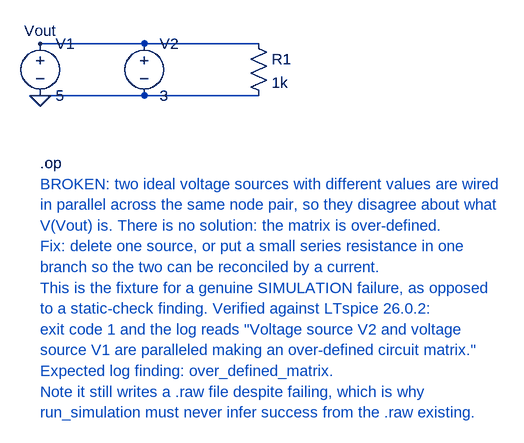
[diagram p0: schematic source_conflict.asc]
source_conflict.asc, the LTspice schematic file:
Version 4.1
SHEET 1 880 680
WIRE 0 16 160 16
WIRE 160 16 336 16
WIRE 0 96 160 96
WIRE 160 96 336 96
FLAG 0 96 0
FLAG 0 16 Vout
SYMBOL voltage 0 0 R0
WINDOW 123 24 124 Left 2
WINDOW 39 0 0 Left 0
SYMATTR InstName V1
SYMATTR Value 5
SYMBOL voltage 160 0 R0
WINDOW 123 24 124 Left 2
WINDOW 39 0 0 Left 0
SYMATTR InstName V2
SYMATTR Value 3
SYMBOL res 320 0 R0
SYMATTR InstName R1
SYMATTR Value 1k
TEXT 0 200 Left 2 !.op
TEXT 0 232 Left 2 ;BROKEN: two ideal voltage sources with different values are wired
TEXT 0 264 Left 2 ;in parallel across the same node pair, so they disagree about what
TEXT 0 296 Left 2 ;V(Vout) is. There is no solution: the matrix is over-defined.
TEXT 0 328 Left 2 ;Fix: delete one source, or put a small series resistance in one
TEXT 0 360 Left 2 ;branch so the two can be reconciled by a current.
TEXT 0 392 Left 2 ;This is the fixture for a genuine SIMULATION failure, as opposed
TEXT 0 424 Left 2 ;to a static-check finding. Verified against LTspice 26.0.2:
TEXT 0 456 Left 2 ;exit code 1 and the log reads "Voltage source V2 and voltage
TEXT 0 488 Left 2 ;source V1 are paralleled making an over-defined circuit matrix."
TEXT 0 520 Left 2 ;Expected log finding: over_defined_matrix.
TEXT 0 552 Left 2 ;Note it still writes a .raw file despite failing, which is why
TEXT 0 584 Left 2 ;run_simulation must never infer success from the .raw existing.

The netlist it stands for:
* source_conflict.asc
V1 Vout 0 5
V2 Vout 0 3
R1 Vout 0 1k
.op
* BROKEN: two ideal voltage sources with different values are wired
* in parallel across the same node pair, so they disagree about what
* V(Vout) is. There is no solution: the matrix is over-defined.
* Fix: delete one source, or put a small series resistance in one
* branch so the two can be reconciled by a current.
* This is the fixture for a genuine SIMULATION failure, as opposed
* to a static-check finding. Verified against LTspice 26.0.2:
* exit code 1 and the log reads "Voltage source V2 and voltage
* source V1 are paralleled making an over-defined circuit matrix."
* Expected log finding: over_defined_matrix.
* Note it still writes a .raw file despite failing, which is why
* run_simulation must never infer success from the .raw existing.
.backanno
.end